# Altium schematic sheet WL-AD9226.SchDoc
size 594 x 420 mm; Address1: Address1; Address2: Address2; Address3: Address3; Address4: Address4; DocumentNumber: Wolf-Lite; SheetNumber: 4; Scale: 1:1; DocumentType: Схема электрическая принципиальная; FirstReferrence: UA3REO/R7KBI
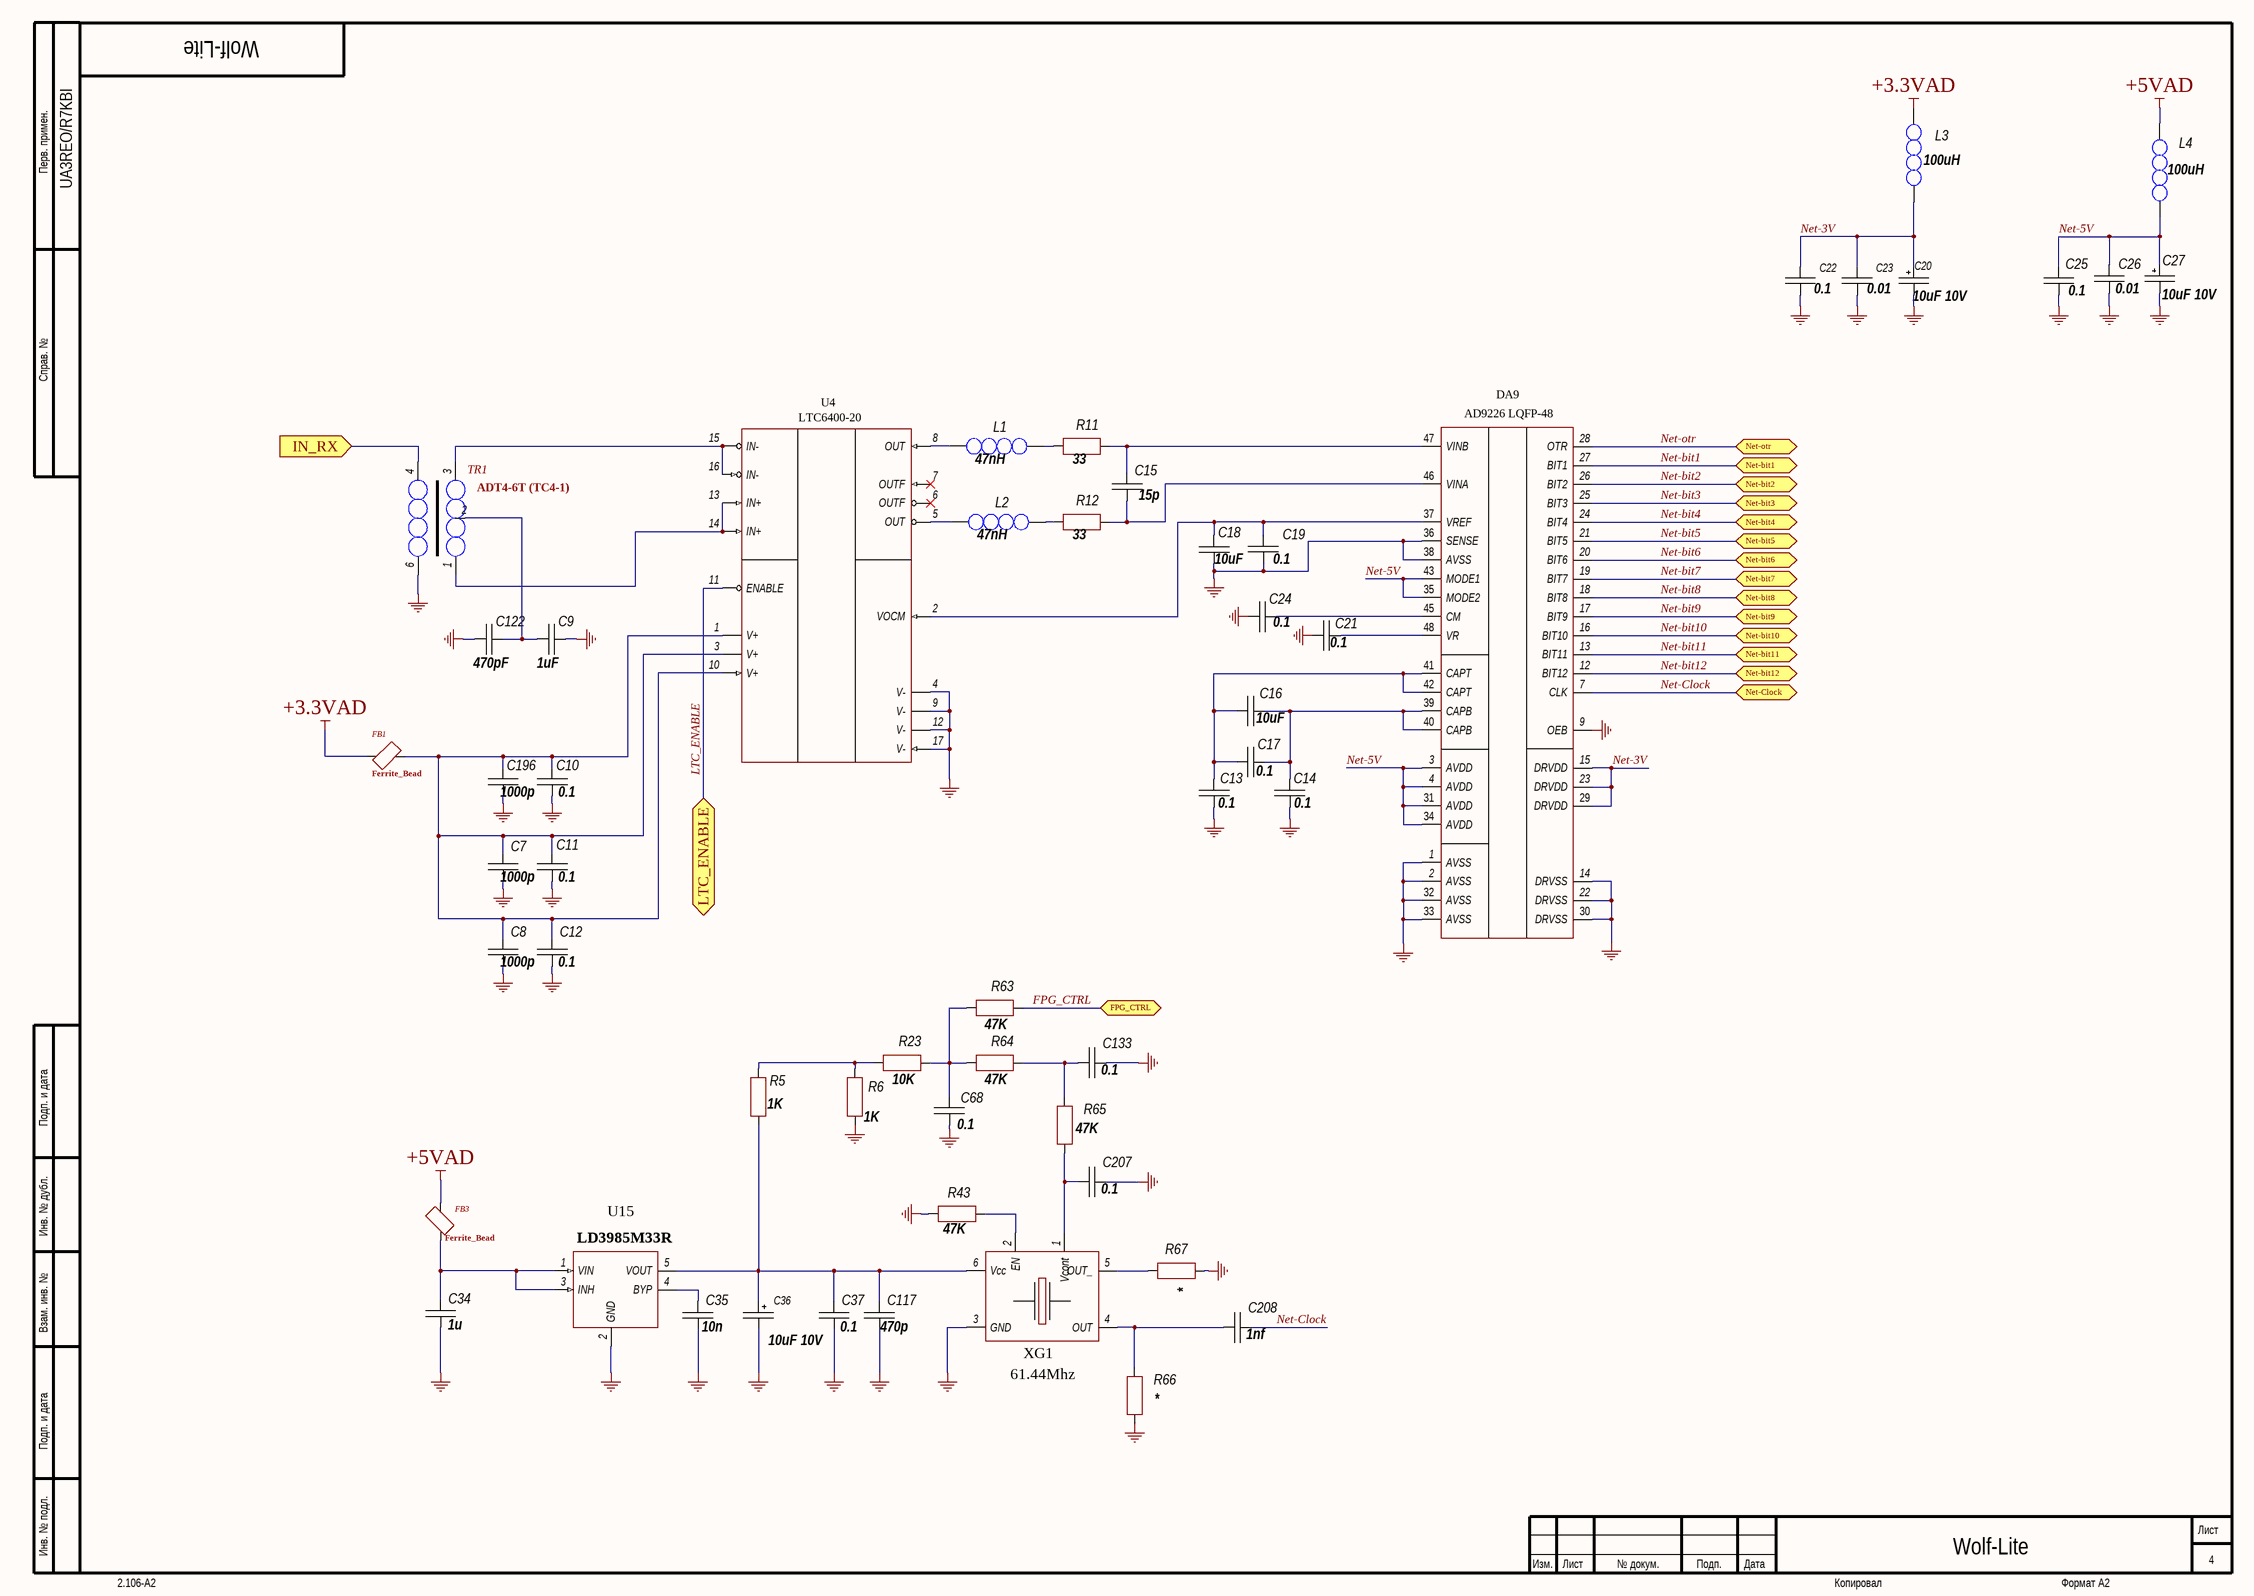
[diagram p0: WL-AD9226.SchDoc]

## Parts
C7  1000p  [CH0805C]
C8  1000p  [CH0805C]
C9  1uF  [CH0805C]
C10  0.1  [CH0805C]
C11  0.1  [CH0805C]
C12  0.1  [CH0805C]
C13  0.1  [CH0805C]
C14  0.1  [CH0805C]
C15  15p  [CH0805C]
C16  10uF  [CH0805C]
C17  0.1  [CH0805C]
C18  10uF  [CH0805C]
C19  0.1  [CH0805C]
C20  10uF 10V  [TANTAL_A]
C21  0.1  [CH0805C]
C22  0.1  [CH0805C]
C23  0.01  [CH0805C]
C24  0.1  [CH0805C]
C25  0.1  [CH0805C]
C26  0.01  [CH0805C]
C27  10uF 10V  [TANTAL_A]
C34  1u  [CH0805C]
C35  10n  [CH0805C]
C36  10uF 10V  [TANTAL_A]
C37  0.1  [CH0805C]
C68  0.1  [CH0805C]
C117  470p  [CH0805C]
C122  470pF  [CH0805C]
C133  0.1  [CH0805C]
C196  1000p  [CH0805C]
C207  0.1  [CH0805C]
C208  1nf  [CH0805C]
DA9  AD9226 LQFP-48  [48-LQFP]
FB1  Ferrite_Bead  [CH0805L]
FB3  Ferrite_Bead  [CH0805L]
L1  47nH  [L1210]
L2  47nH  [L1210]
L3  100uH  [CH0805L]
L4  100uH  [CH0805L]
R5  1K  [CH0805R]
R6  1K  [CH0805R]
R11  33  [CH0805R]
R12  33  [CH0805R]
R23  10K  [CH0805R]
R43  47K  [CH0805R]
R63  47K  [CH0805R]
R64  47K  [CH0805R]
R65  47K  [CH0805R]
R66  *  [CH0805R]
R67  *  [CH0805R]
TR1  ADT4-6T (TC4-1)  [TC1-4]
U4  LTC6400-20  [16-QFN (3x3)]
U15  LD3985M33R  [SOT23-5]
XG1  61.44Mhz  [OCS: GENA]

## Ports
FPG_CTRL (bidir), IN_RX (in), LTC_ENABLE (bidir), Net-bit1 (bidir), Net-bit2 (bidir), Net-bit3 (bidir), Net-bit4 (bidir), Net-bit5 (bidir), Net-bit6 (bidir), Net-bit7 (bidir), Net-bit8 (bidir), Net-bit9 (bidir), Net-bit10 (bidir), Net-bit11 (bidir), Net-bit12 (bidir), Net-Clock (bidir), Net-otr (bidir)

## Nets
+3.3VAD: FB1.1 L3.2
+5VAD: FB3.2 L4.2
GND: C7.1 C8.1 C9.1 C10.1 C11.1 C12.1 C13.1 C14.1 C18.2 C19.1 C20.2 C21.1 C22.1 C23.1 C24.2 C25.1 C26.1 C27.2 C34.2 C35.2 C36.2 C37.2 C68.1 C117.2 C122.2 C133.2 C196.1 C207.2 DA9.1(AVSS) DA9.2(AVSS) DA9.9(OEB) DA9.14(DRVSS) DA9.22(DRVSS) DA9.30(DRVSS) DA9.32(AVSS) DA9.33(AVSS) DA9.36(SENSE) DA9.38(AVSS) R6.2 R43.2 R66.1 R67.1 TR1.6 U4.4(V-) U4.9(V-) U4.12(V-) U4.17(V-) U15.2(GND) XG1.3(GND)
FPG_CTRL: R63.1 ; port FPG_CTRL
IN_RX: TR1.4 ; port IN_RX
LTC_ENABLE: U4.11(ENABLE) ; port LTC_ENABLE
Net-3V: C20.1 C22.2 C23.2 DA9.15(DRVDD) DA9.23(DRVDD) DA9.29(DRVDD) L3.1
Net-5V: C25.2 C26.2 C27.1 DA9.3(AVDD) DA9.4(AVDD) DA9.31(AVDD) DA9.34(AVDD) DA9.35(MODE2) DA9.43(MODE1) L4.1
Net-bit1: DA9.27(BIT1) ; port Net-bit1
Net-bit2: DA9.26(BIT2) ; port Net-bit2
Net-bit3: DA9.25(BIT3) ; port Net-bit3
Net-bit4: DA9.24(BIT4) ; port Net-bit4
Net-bit5: DA9.21(BIT5) ; port Net-bit5
Net-bit6: DA9.20(BIT6) ; port Net-bit6
Net-bit7: DA9.19(BIT7) ; port Net-bit7
Net-bit8: DA9.18(BIT8) ; port Net-bit8
Net-bit9: DA9.17(BIT9) ; port Net-bit9
Net-bit10: DA9.16(BIT10) ; port Net-bit10
Net-bit11: DA9.13(BIT11) ; port Net-bit11
Net-bit12: DA9.12(BIT12) ; port Net-bit12
Net-Clock: C208.2 DA9.7(CLK) ; port Net-Clock
Net-otr: DA9.28(OTR) ; port Net-otr
NetC7_2: C7.2 C8.2 C10.2 C11.2 C12.2 C196.2 FB1.2 U4.1(V+) U4.3(V+) U4.10(V+)
NetC9_2: C9.2 C122.1 TR1.2
NetC13_2: C13.2 C16.1 C17.1 DA9.41(CAPT) DA9.42(CAPT)
NetC14_2: C14.2 C16.2 C17.2 DA9.39(CAPB) DA9.40(CAPB)
NetC15_1: C15.1 DA9.46(VINA) R12.2
NetC15_2: C15.2 DA9.47(VINB) R11.2
NetC18_1: C18.1 C19.2 DA9.37(VREF) U4.2(VOCM)
NetC21_2: C21.2 DA9.48(VR)
NetC24_1: C24.1 DA9.45(CM)
NetC34_1: C34.1 FB3.1 U15.1(VIN) U15.3(INH)
NetC35_1: C35.1 U15.4(BYP)
NetC36_1: C36.1 C37.1 C117.1 R5.1 U15.5(VOUT) XG1.6(Vcc)
NetC68_2: C68.2 R23.1 R63.2 R64.2
NetC133_1: C133.1 R64.1 R65.2
NetC207_1: C207.1 R65.1 XG1.1(Vcont)
NetC208_1: C208.1 R66.2 XG1.4(OUT)
NetL1_1: L1.1 R11.1
NetL1_2: L1.2 U4.8(OUT)
NetL2_1: L2.1 R12.1
NetL2_2: L2.2 U4.5(OUT)
NetR5_2: R5.2 R6.1 R23.2
NetR43_1: R43.1 XG1.2(EN)
NetR67_2: R67.2 XG1.5(OUT_)
NetTR1_1: TR1.1 U4.13(IN+) U4.14(IN+)
NetTR1_3: TR1.3 U4.15(IN-) U4.16(IN-)

Not connected (* = marked no-connect by the designer): U4 6(OUTF)* 7(OUTF)*

## Notes on the sheet
- Перв. примен.
- Справ. №
- Подп. и дата
- Инв. № дубл.
- Взам. инв. №
- Инв. № подл.
- Изм.
- Лист
- № докум.
- Подп.
- Дата
- 2.106-A2
- Копировал
- Формат А2

## Library data of the parts
C7-C19 C21-C26 C34 C35 C37 C68 C117 C122 C133 C196 C207 C208 = Capacitor: Manufacturer: *; Model: *; HelpURL: *; ComponentKind: *; Value: *
C20 C27 C36 = TantalCap: Manufacturer: *; Model: *; HelpURL: *; ComponentKind: *; Value: *
DA9 = AD9226 LQFP
FB1 FB3 = FB
L1-L4 = Inductor: Manufacturer: *; Model: *; HelpURL: *; ComponentKind: *; Value: *
R5 R6 R11 R12 R23 R43 R63-R67 = Resistor: Manufacturer: *; Model: *; HelpURL: *; ComponentKind: *; Value: *
TR1 = TC4-1
U4 = LTC6400-1
U15 = LD3985M33R_SOT23
XG1 = Generator